# Altium schematic sheet Driver Morpheus SENSOR CORRENTE.SchDoc
size A4
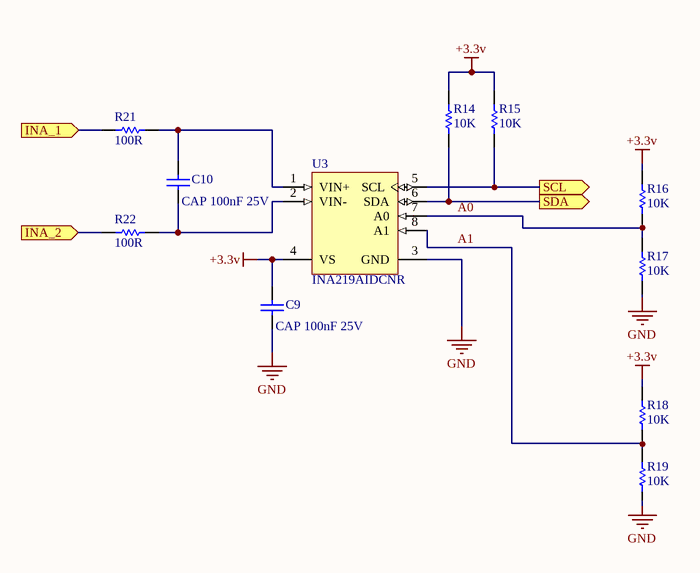
[diagram p0: Driver Morpheus SENSOR CORRENTE.SchDoc]

## Parts
C9  CAP 100nF 25V  [CAPC0402(1005)60_L]
C10  CAP 100nF 25V  [CAPC0402(1005)60_L]
R14  value 10K  [RES-0402]  (hidden comment: RC0402JR-071KL)
R15  value 10K  [RES-0402]  (hidden comment: RC0402JR-071KL)
R16  value 10K  [RES-0402]  (hidden comment: RC0402JR-071KL)
R17  value 10K  [RES-0402]  (hidden comment: RC0402JR-071KL)
R18  value 10K  [RES-0402]  (hidden comment: RC0402JR-071KL)
R19  value 10K  [RES-0402]  (hidden comment: RC0402JR-071KL)
R21  value 100R  [RES-0402]  (hidden comment: RC0402JR-071KL)
R22  value 100R  [RES-0402]  (hidden comment: RC0402JR-071KL)
U3  INA219AIDCNR  [DCN0008A_M]

## Ports
INA_1 (in), INA_2 (in), SCL (out), SDA (out)

## Nets
+3.3v: C9.2 R14.2 R15.2 R16.2 R18.2 U3.4(VS)
GND: C9.1 R17.1 R19.1 U3.3(GND)
A0: R16.1 R17.2 U3.7(A0)
A1: R18.1 R19.2 U3.8(A1)
INA_1: R21.2 ; port INA_1
INA_2: R22.2 ; port INA_2
SCL: R15.1 U3.5(SCL) ; port SCL
SDA: R14.1 U3.6(SDA) ; port SDA
NetC10_1: C10.1 R22.1 U3.2(VIN-)
NetC10_2: C10.2 R21.1 U3.1(VIN+)

## Library data of the parts
C9 C10 = CMP-1034-02073-1: CAP 100nF 25V ±20% 0402 (1005 Metric) Thickness 0.6mm SMD; Tolerance: Â±20%; Case-EIA: 0402; Case-Metric: 1005; Rated Voltage: 25 V; Value: 100nF; Max Thickness: 0.6 mm; Technology: SMT
R14-R19 = RES 1K 0402: RES SMD 10K OHM 5% 1/16W 0402
R21 R22 = RES 1K 0402: RES SMD 100 OHM 5% 1/16W 0402
U3 = CMP-0704-00041-2: Zero-Drift, Bi-directional Current / Power Monitor, 3 to 5.5 V, -40 to 125 degC, 8-pin SOP (DCN8), Green (RoHS & no Sb/Br); Manufacturer: Texas Instruments; Input Offset (+/-)(Max)(uV): 100; Small-Signal Bandwidth(Typ)(MHz): 0.011; SubFamily: Current Shunt Monitor; Rating: Catalog; Quiescent Current (+/-)(Typ)(mA): 0.7; Vs(Max)(V): 5.5; Common Mode Range(Min)(V): 0; Vs(Min)(V): 3; Common Mode Range(Max)(V): 26; Gain(V/V): 1, 0.5, 0.25, 0.125; ComponentLink3URL: http://www.ti.com/lit/ml/mpds099c/mpds099c.pdf; ComponentLink2URL: http://www.ti.com/general/docs/lit/getliterature.tsp?genericPartNumber=INA219&fileType=pdf; PackageReference: DCN0008A; ComponentLink1URL: http://www.ti.com/; ComponentLink1Description: Manufacturer URL; Code_JEDEC: MO-178; CMRR(Min)(dB): 100; DatasheetVersion: SBOS448F; Mounting Technology: Surface Mount; ComponentLink3Description: Package Specification; PartNumber: INA219AIDCNR; PackageVersion: 4202106/D, 11/2009; Eco-Plan: Green (RoHS & no Sb/Br); ComponentLink2Description: Datasheet; PackageDescription: 8-Pin Plastic Small Outline, Body 1.6 x 2.9 mm, Pitch 0.65 mm